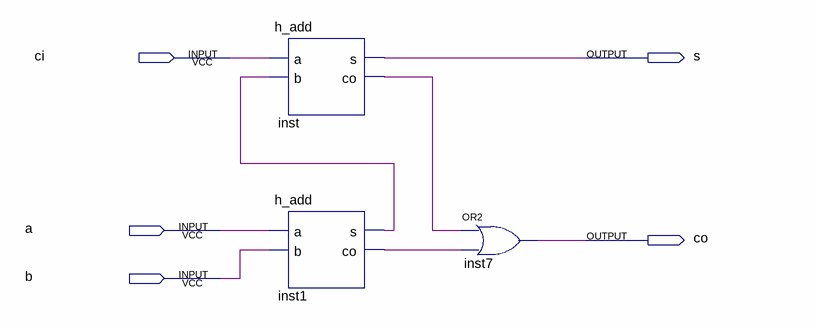
[diagram p0: schematic sheet]
// Quartus schematic HA.bdf as structural Verilog: 3 symbols, 5 pins
module HA (
  input  ci,
  input  a,
  input  b,
  output s,
  output co
);

  wire inst1_co, inst1_s, inst_co;

  h_add inst (.a(ci), .b(inst1_s), .s(s), .co(inst_co));
  h_add inst1 (.a(a), .b(b), .s(inst1_s), .co(inst1_co));
  or inst7 (co, inst_co, inst1_co);
endmodule
